# EAGLE schematic MP2636-Single-Cell-BMS (EAGLE 9.6.2)
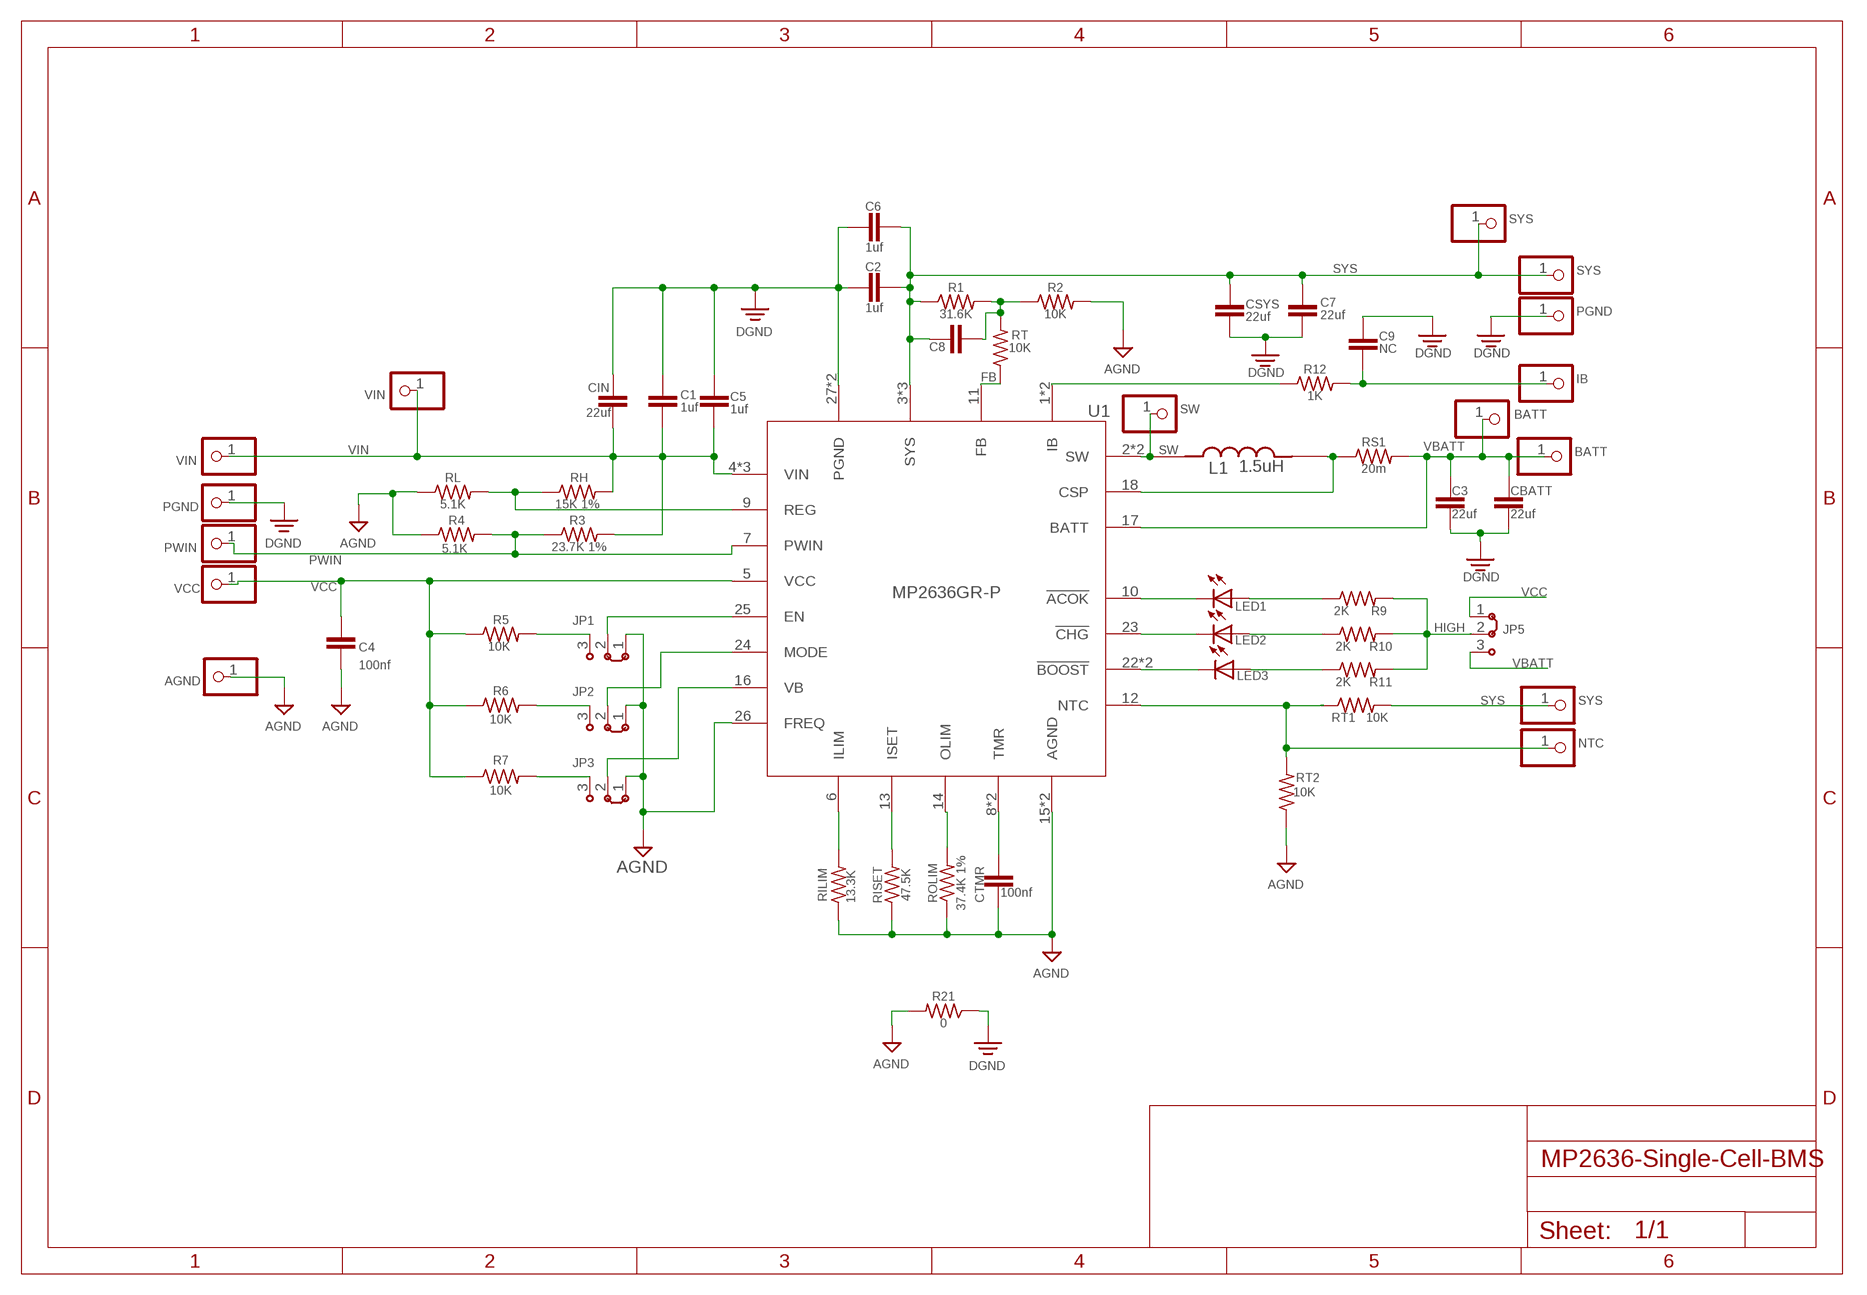
[diagram p0: schematic, sheet 1]

## Parts
C1  1uf  C_CHIP-0805(2012-METRIC)  [CAPC2012X110]
C2  1uf  C_CHIP-0805(2012-METRIC)  [CAPC2012X110]
C3  22uf  C_CHIP-0805(2012-METRIC)  [CAPC2012X110]
C4  100nf  C_CHIP-0805(2012-METRIC)  [CAPC2012X110]
C5  1uf  C_CHIP-0805(2012-METRIC)  [CAPC2012X110]
C6  1uf  C_CHIP-0805(2012-METRIC)  [CAPC2012X110]
C7  22uf  C_CHIP-0805(2012-METRIC)  [CAPC2012X110]
C8  C_CHIP-0805(2012-METRIC)  [CAPC2012X110]
C9  NC  C_CHIP-0805(2012-METRIC)  [CAPC2012X110]
CBATT  22uf  C_CHIP-0805(2012-METRIC)  [CAPC2012X110]
CIN  22uf  C_CHIP-0805(2012-METRIC)  [CAPC2012X110]
CSYS  22uf  C_CHIP-0805(2012-METRIC)  [CAPC2012X110]
CTMR  100nf  C_CHIP-0805(2012-METRIC)  [CAPC2012X110]
F  SYS  PINHD-1X1  [1X01]
JP1  J2X2MM  [04C]
JP2  J2X2MM  [04C]
JP3  J2X2MM  [04C]
JP4  VIN  PINHD-1X1  [1X01]
JP5  J2X2MM  [04C]
JP6  PGND  PINHD-1X1  [1X01]
JP7  PWIN  PINHD-1X1  [1X01]
JP8  VCC  PINHD-1X1  [1X01]
JP9  VIN  PINHD-1X1  [1X01]
JP10  AGND  PINHD-1X1  [1X01]
JP11  SYS  PINHD-1X1  [1X01]
JP12  IB  PINHD-1X1  [1X01]
JP13  BATT  PINHD-1X1  [1X01]
JP14  BATT  PINHD-1X1  [1X01]
JP15  NTC  PINHD-1X1  [1X01]
JP16  SW  PINHD-1X1  [1X01]
JP17  PGND  PINHD-1X1  [1X01]
JP18  SYS  PINHD-1X1  [1X01]
L1  1.5uH  LQH5BPN2R2NT0L  [IND_LQH5BPN2R2NT0L]
LED1  LEDCHIP-LED0805  [CHIP-LED0805]
LED2  LEDCHIP-LED0805  [CHIP-LED0805]
LED3  LEDCHIP-LED0805  [CHIP-LED0805]
R1  31.6K  R-US_CHIP-0805(2012-METRIC)  [RESC2012X65]
R2  10K  R-US_CHIP-0805(2012-METRIC)  [RESC2012X65]
R3  23.7K 1%  R-US_CHIP-0805(2012-METRIC)  [RESC2012X65]
R4  5.1K  R-US_CHIP-0805(2012-METRIC)  [RESC2012X65]
R5  10K  R-US_CHIP-0805(2012-METRIC)  [RESC2012X65]
R6  10K  R-US_CHIP-0805(2012-METRIC)  [RESC2012X65]
R7  10K  R-US_CHIP-0805(2012-METRIC)  [RESC2012X65]
R9  2K  R-US_CHIP-0805(2012-METRIC)  [RESC2012X65]
R10  2K  R-US_CHIP-0805(2012-METRIC)  [RESC2012X65]
R11  2K  R-US_CHIP-0805(2012-METRIC)  [RESC2012X65]
R12  1K  R-US_CHIP-0805(2012-METRIC)  [RESC2012X65]
R21  0  R-US_CHIP-0805(2012-METRIC)  [RESC2012X65]
RH  15K 1%  R-US_CHIP-0805(2012-METRIC)  [RESC2012X65]
RILIM  13.3K  R-US_CHIP-0805(2012-METRIC)  [RESC2012X65]
RISET  47.5K  R-US_CHIP-0805(2012-METRIC)  [RESC2012X65]
RL  5.1K  R-US_CHIP-0805(2012-METRIC)  [RESC2012X65]
ROLIM  37.4K 1%  R-US_CHIP-0805(2012-METRIC)  [RESC2012X65]
RS1  20m  R-US_CHIP-0805(2012-METRIC)  [RESC2012X65]
RT  10K  R-US_CHIP-0805(2012-METRIC)  [RESC2012X65]
RT1  10K  R-US_CHIP-0805(2012-METRIC)  [RESC2012X65]
RT2  10K  R-US_CHIP-0805(2012-METRIC)  [RESC2012X65]
U1  MP2636GR-P  [IC_MP2636GR-P]

## Nets
AGND: CTMR.2 JP10.1 R2.2 R4.1 R21.2 RILIM.1 RISET.1 RL.1 ROLIM.1 RT2.1 U1.15(AGND) U1.15_1(AGND)
DGND: C1.1 C2.1 C3.1 C4.2 C5.1 C6.1 C7.1 C9.2 CBATT.1 CIN.1 CSYS.1 JP1.1 JP2.1 JP3.1 JP6.1 JP17.1 R21.1 U1.26(FREQ) U1.27(PGND) U1.28(PGND) ; supply symbol labelled AGND
FB: RT.1 U1.11(FB)
HIGH: JP5.2
IB: C9.1 JP12.1 R12.2
N$1: R12.1 U1.1(IB) U1.1_1(IB)
N$2: JP1.3 R5.2
N$3: JP1.2 U1.25(EN)
N$4: JP2.2 U1.24(MODE)
N$5: JP3.2 U1.16(VB)
N$6: JP2.3 R6.2
N$7: JP3.3 R7.2
N$8: RH.1 RL.2 U1.9(REG)
N$9: LED1.C U1.10(!ACOK)
N$10: C8.2 R1.2 R2.1 RT.2
N$11: LED2.C U1.23(!CHG)
N$12: L1.2 RS1.1 U1.18(CSP)
N$14: LED3.C U1.22(!BOOST) U1.22_1(!BOOST)
N$15: LED1.A R9.1
N$16: LED2.A R10.1
N$17: LED3.A R11.1
N$18: R9.2 R10.2 R11.2
N$20: RILIM.2 U1.6(ILIM)
N$21: RISET.2 U1.13(ISET)
N$22: ROLIM.2 U1.14(OLIM)
N$23: CTMR.1 U1.8(TMR) U1.8_1(TMR)
NTC: JP15.1 RT1.1 RT2.2 U1.12(NTC)
PWIN: JP7.1 R3.1 R4.2 U1.7(PWIN)
SW: JP16.1 L1.1 U1.2(SW) U1.21(SW)
SYS: C2.2 C6.2 C7.2 C8.1 CSYS.2 F.1 JP11.1 JP18.1 R1.1 RT1.2 U1.3(SYS) U1.20(SYS) U1.29(SYS)
VBATT: C3.2 CBATT.2 JP5.3 JP13.1 JP14.1 RS1.2 U1.17(BATT)
VCC: C4.1 JP5.1 JP8.1 R5.1 R6.1 R7.1 U1.5(VCC)
VIN: C1.2 C5.2 CIN.2 JP4.1 JP9.1 R3.2 RH.2 U1.4(VIN) U1.19(VIN) U1.30(VIN)

## Library data of the parts
C1-C9 CBATT CIN CSYS CTMR = Capacitor:C: Capacitor - Generic; CATEGORY: Capacitor
F JP4 JP6-JP18 = Connector:PINHD-1X1: PIN HEADER; CATEGORY: CONNECTOR; SUB-CATEGORY: PIN-HEADER
JP1-JP3 JP5 = jumper:J2: Jumper switch 2 x 2.5 mm
L1 = LQH5BPN2R2NT0L:LQH5BPN2R2NT0L: Inductor Power Chip Shielded Wirewound 1.2uH 30% 100KHz Ferrite 3.1A 0.0228Ohm DCR 2020 T/R; AVAILABILITY: Unavailable; DESCRIPTION: Inductor with Inductance: 2.2uH Tol. +/-30%, Package: 2020 (5050); MF: Murata; MP: LQH5BPN2R2NT0L; PACKAGE: NONSTANDARD; PRICE: None
LED1-LED3 = led:LED: LED OSRAM: - CHIPLED LG R971, LG N971, LY N971, LG Q971, LY Q971, LO R971, LY R971 LH N974, LH R974 LS Q976, LO Q976, LY Q976 LO Q996 - Hyper CHIPLED LW Q18S LB Q993, LB Q99A, LB R99A - SideLED LS A670, LO A670, LY A670, LG A670, LP A670 LB A673, LV A673, LT A673, LW A673 LH A674 LY A675 LS A676, LA A676, LO A676, LY A676, LW A676 LS A679, LY A679, LG A679 - Hyper Micro SIDELED® LS Y876, LA Y876, LO Y876, LY Y876 LT Y87S - SmartLED LW L88C, LW L88S LB L89C, LB L89S, LG L890 LS L89K, LO L89K, LY L89K LS L896, LA L896, LO L896, LY L896 - TOPLED LS T670, LO T670, LY T670, LG T670, LP T670 LSG T670, LSP T670, LSY T670, LOP T670, LYG T670 LG T671, LOG T671, LSG T671 LB T673, LV T673, LT T673, LW T673 LH T674 LS T676, LA T676, LO T676, LY T676, LB T676, LH T676, LSB T676, LW T676 LB T67C, LV T67C, LT T67C, LS T67K, LO T67K, LY T67K, LW E67C LS E67B, LA E67B, LO E67B, LY E67B, LB E67C, LV E67C, LT E67C LW T67C LS T679, LY T679, LG T679 LS T770, LO T770, LY T770, LG T770, LP T770 LB T773, LV T773, LT T773, LW T773 LH T774 LS E675, LA E675, LY E675, LS T675 LS T776, LA T776, LO T776, LY T776, LB T776 LHGB T686 LT T68C, LB T68C - Hyper Mini TOPLED® LB M676 - Mini TOPLED Santana® LG M470 LS M47K, LO M47K, LY M47K Source: http://www.osram.convergy.de/
R1-R7 R9-R12 R21 RH RILIM RISET RL ROLIM RS1 RT RT1 RT2 = Resistor:R-US: Resistor Fixed - ANSI; CATEGORY: Resistor; SUB-CATEGORY: Fixed
U1 = MP2636GR-P:MP2636GR-P: Ic Batt Charger Li-Ion Sgl 30qfn Check prices <https://pricing.snapeda.com/parts/MP2636GR-P/Monolithic%20Power/view-part?ref=eda>; AVAILABILITY: Warning; DESCRIPTION: Charger IC Lithium Ion/Polymer 30-QFN (4x4); MF: Monolithic Power; MP: MP2636GR-P; PACKAGE: QFN-30 Monolithic Power; PRICE: None; PURCHASE-URL: https://pricing.snapeda.com/search/part/MP2636GR-P/?ref=eda